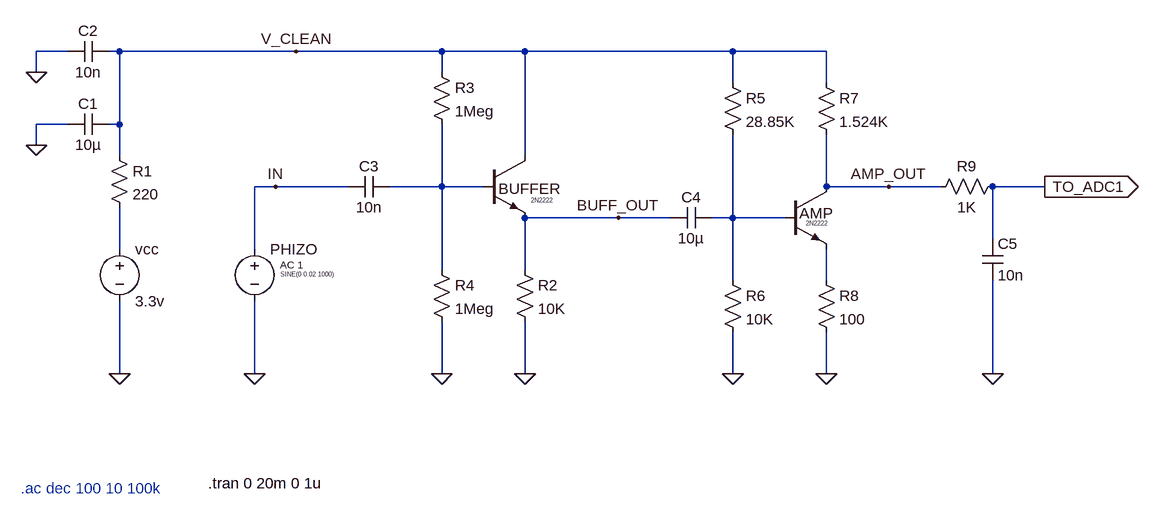
[diagram p0: schematic amplifier_circuit.asc]
amplifier_circuit.asc, the LTspice schematic file:
Version 4.1
SHEET 1 1356 680
WIRE -480 -224 -528 -224
WIRE -400 -224 -416 -224
WIRE -128 -224 -400 -224
WIRE 96 -224 -128 -224
WIRE 224 -224 96 -224
WIRE 544 -224 224 -224
WIRE 688 -224 544 -224
WIRE -528 -192 -528 -224
WIRE 96 -192 96 -224
WIRE 544 -176 544 -224
WIRE 688 -176 688 -224
WIRE -480 -112 -528 -112
WIRE -400 -112 -400 -224
WIRE -400 -112 -416 -112
WIRE -528 -80 -528 -112
WIRE -400 -64 -400 -112
WIRE 224 -64 224 -224
WIRE -160 -16 -192 -16
WIRE -48 -16 -160 -16
WIRE 96 -16 96 -112
WIRE 96 -16 16 -16
WIRE 160 -16 96 -16
WIRE 688 -16 688 -96
WIRE 784 -16 688 -16
WIRE 864 -16 784 -16
WIRE 1024 -16 944 -16
WIRE 368 32 224 32
WIRE 448 32 368 32
WIRE 544 32 544 -96
WIRE 544 32 512 32
WIRE 624 32 544 32
WIRE 944 64 944 -16
WIRE -400 80 -400 16
WIRE -192 80 -192 -16
WIRE 96 112 96 -16
WIRE 224 112 224 32
WIRE 544 128 544 32
WIRE 688 128 688 80
WIRE -400 272 -400 160
WIRE -192 272 -192 160
WIRE 96 272 96 192
WIRE 224 272 224 192
WIRE 544 272 544 208
WIRE 688 272 688 208
WIRE 944 272 944 128
FLAG 224 272 0
FLAG 96 272 0
FLAG -192 272 0
FLAG -160 -16 IN
FLAG 544 272 0
FLAG 688 272 0
FLAG -528 -80 0
FLAG -528 -192 0
FLAG -128 -224 V_CLEAN
FLAG -400 272 0
FLAG 784 -16 AMP_OUT
FLAG 368 32 BUFF_OUT
FLAG 944 272 0
FLAG 1024 -16 TO_ADC1
IOPIN 1024 -16 Out
SYMBOL voltage -400 64 R0
SYMATTR InstName vcc
SYMATTR Value 3.3v
SYMBOL voltage -192 64 R0
WINDOW 3 40 55 Left 0
WINDOW 123 39 40 Left 1
WINDOW 39 0 0 Left 0
SYMATTR Value SINE(0 0.02 1000)
SYMATTR Value2 AC 1
SYMATTR InstName PHIZO
SYMBOL res -416 -80 R0
SYMATTR InstName R1
SYMATTR Value 220
SYMBOL cap -416 -208 M270
WINDOW 0 32 32 VTop 2
WINDOW 3 0 32 VBottom 2
SYMATTR InstName C2
SYMATTR Value 10n
SYMBOL npn 160 -64 R0
WINDOW 0 23 51 Left 2
WINDOW 3 73 69 Left 0
SYMATTR InstName BUFFER
SYMATTR Value 2N2222
SYMBOL res 208 96 R0
SYMATTR InstName R2
SYMATTR Value 10K
SYMBOL res 80 -208 R0
SYMATTR InstName R3
SYMATTR Value 1Meg
SYMBOL res 80 96 R0
SYMATTR InstName R4
SYMATTR Value 1Meg
SYMBOL cap 16 -32 R90
WINDOW 0 0 32 VBottom 2
WINDOW 3 32 32 VTop 2
SYMATTR InstName C3
SYMATTR Value 10n
SYMBOL npn 624 -16 R0
WINDOW 0 22 41 Left 2
WINDOW 3 32 56 Left 0
SYMATTR InstName AMP
SYMATTR Value 2N2222
SYMBOL cap 512 16 R90
WINDOW 0 0 32 VBottom 2
WINDOW 3 32 32 VTop 2
SYMATTR InstName C4
SYMATTR Value 10µ
SYMBOL cap -416 -96 M270
WINDOW 0 32 32 VTop 2
WINDOW 3 0 32 VBottom 2
SYMATTR InstName C1
SYMATTR Value 10µ
SYMBOL res 528 -192 R0
SYMATTR InstName R5
SYMATTR Value 28.85K
SYMBOL res 528 112 R0
SYMATTR InstName R6
SYMATTR Value 10K
SYMBOL res 672 -192 R0
SYMATTR InstName R7
SYMATTR Value 1.524K
SYMBOL res 672 112 R0
SYMATTR InstName R8
SYMATTR Value 100
SYMBOL res 960 -32 R90
WINDOW 0 0 56 VBottom 2
WINDOW 3 32 56 VTop 2
SYMATTR InstName R9
SYMATTR Value 1K
SYMBOL cap 928 64 R0
SYMATTR InstName C5
SYMATTR Value 10n
TEXT -552 448 Left 2 ;.ac dec 100 10 100k
TEXT -264 440 Left 2 !.tran 0 20m 0 1u

The netlist it stands for:
* amplifier_circuit.asc
vcc N003 0 3.3v
V§PHIZO IN 0 SINE(0 0.02 1000) AC 1
R1 V_CLEAN N003 220
C2 V_CLEAN 0 10n
Q§BUFFER V_CLEAN N001 BUFF_OUT 0 2N2222
R2 BUFF_OUT 0 10K
R3 V_CLEAN N001 1Meg
R4 N001 0 1Meg
C3 N001 IN 10n
Q§AMP AMP_OUT N002 N004 0 2N2222
C4 N002 BUFF_OUT 10µ
C1 V_CLEAN 0 10µ
R5 V_CLEAN N002 28.85K
R6 N002 0 10K
R7 V_CLEAN AMP_OUT 1.524K
R8 N004 0 100
R9 TO_ADC1 AMP_OUT 1K
C5 TO_ADC1 0 10n
.model NPN NPN
.model PNP PNP
.lib standard.bjt
* .ac dec 100 10 100k
.tran 0 20m 0 1u
.backanno
.end